# Altium project InterfaceUtil.PrjPcb
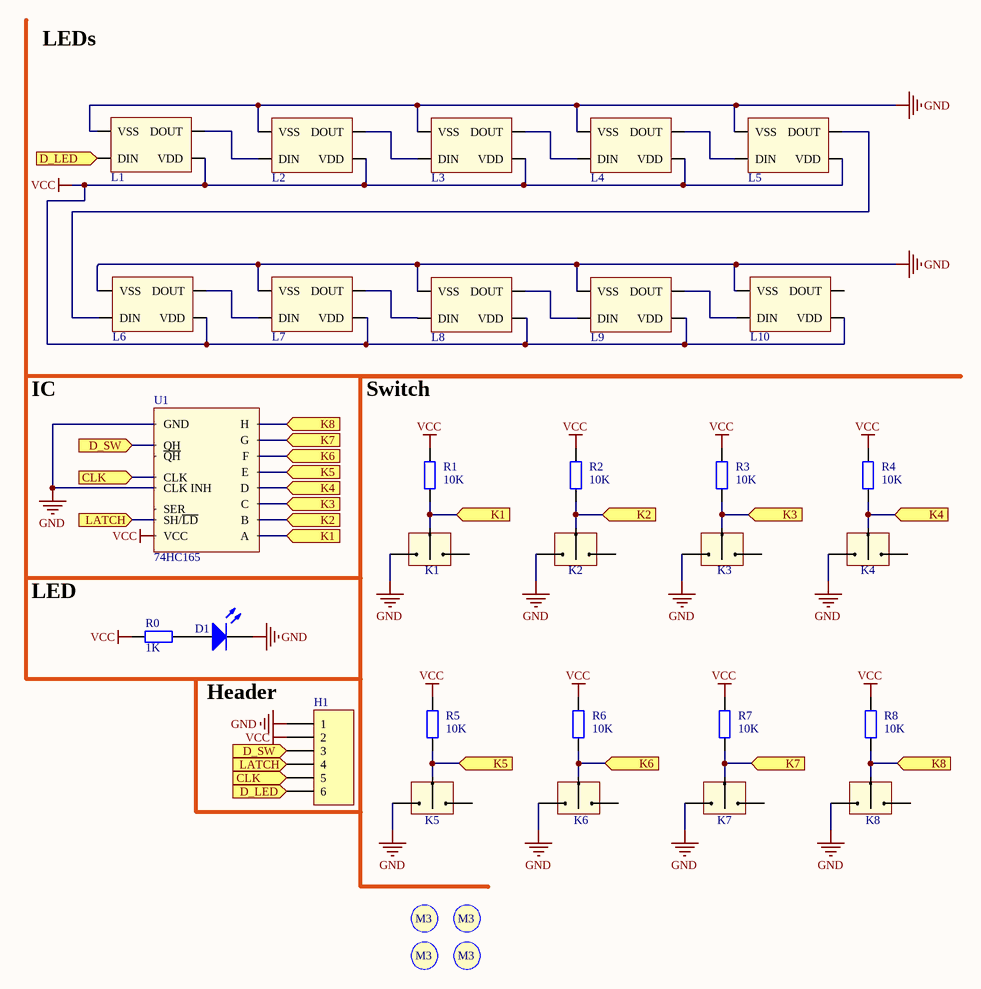
[diagram p0: InterfaceUtil.SchDoc]
1 sheet, 34 parts. Net scope: flat (ports and power ports of the same name join across sheets).
Board file: InterfaceUtil.PcbDoc

## Sheet InterfaceUtil.SchDoc
size A4

### Parts
D1  LED2  [3.2X1.6X1.1]  (value not drawn)
H1  Header 6  [MOLEX SPOX 6X1H]  (value not drawn)
K1  Switch  [SWITCH]  (value not drawn)
K2  Switch  [SWITCH]  (value not drawn)
K3  Switch  [SWITCH]  (value not drawn)
K4  Switch  [SWITCH]  (value not drawn)
K5  Switch  [SWITCH]  (value not drawn)
K6  Switch  [SWITCH]  (value not drawn)
K7  Switch  [SWITCH]  (value not drawn)
K8  Switch  [SWITCH]  (value not drawn)
L1  NeoPixel  [Neopixel]  (value not drawn)
L2  NeoPixel  [Neopixel]  (value not drawn)
L3  NeoPixel  [Neopixel]  (value not drawn)
L4  NeoPixel  [Neopixel]  (value not drawn)
L5  NeoPixel  [Neopixel]  (value not drawn)
L6  NeoPixel  [Neopixel]  (value not drawn)
L7  NeoPixel  [Neopixel]  (value not drawn)
L8  NeoPixel  [Neopixel]  (value not drawn)
L9  NeoPixel  [Neopixel]  (value not drawn)
L10  NeoPixel  [Neopixel]  (value not drawn)
R0  value 1K  [3.2X1.6X1.1]  (hidden comment: Res2)
R1  value 10K  [3.2X1.6X1.1]  (hidden comment: Res2)
R2  value 10K  [3.2X1.6X1.1]  (hidden comment: Res2)
R3  value 10K  [3.2X1.6X1.1]  (hidden comment: Res2)
R4  value 10K  [3.2X1.6X1.1]  (hidden comment: Res2)
R5  value 10K  [3.2X1.6X1.1]  (hidden comment: Res2)
R6  value 10K  [3.2X1.6X1.1]  (hidden comment: Res2)
R7  value 10K  [3.2X1.6X1.1]  (hidden comment: Res2)
R8  value 10K  [3.2X1.6X1.1]  (hidden comment: Res2)
S1  Screw M3  [Screw M3]  (value not drawn)
S2  Screw M3  [Screw M3]  (value not drawn)
S3  Screw M3  [Screw M3]  (value not drawn)
S4  Screw M3  [Screw M3]  (value not drawn)
U1  74HC165  [16 pins SOIC, TI]

### Ports
CLK, D_LED, D_SW, K1, K2, K3, K4, K5, K6, K7, K8, LATCH

### Nets
GND: D1.2(K) H1.1 K1.0(L) K2.0(L) K3.0(L) K4.0(L) K5.0(L) K6.0(L) K7.0(L) K8.0(L) L1.1(VSS) L2.1(VSS) L3.1(VSS) L4.1(VSS) L5.1(VSS) L6.1(VSS) L7.1(VSS) L8.1(VSS) L9.1(VSS) L10.1(VSS) U1.8(GND) U1.15(CLK_INH)
VCC: H1.2 L1.3(VDD) L2.3(VDD) L3.3(VDD) L4.3(VDD) L5.3(VDD) L6.3(VDD) L7.3(VDD) L8.3(VDD) L9.3(VDD) L10.3(VDD) R0.1 R1.2 R2.2 R3.2 R4.2 R5.2 R6.2 R7.2 R8.2 U1.16(VCC)
NetD1_1: D1.1(A) R0.2
NetH1_3: H1.3 U1.9(QH) ; port D_SW
NetH1_4: H1.4 U1.1(SH/~{LD}) ; port LATCH
NetH1_5: H1.5 U1.2(CLK) ; port CLK
NetH1_6: H1.6 L1.2(DIN) ; port D_LED
NetK1_1: K1.1(M) R1.1 U1.11(A) ; port K1
NetK2_1: K2.1(M) R2.1 U1.12(B) ; port K2
NetK3_1: K3.1(M) R3.1 U1.13(C) ; port K3
NetK4_1: K4.1(M) R4.1 U1.14(D) ; port K4
NetK5_1: K5.1(M) R5.1 U1.3(E) ; port K5
NetK6_1: K6.1(M) R6.1 U1.4(F) ; port K6
NetK7_1: K7.1(M) R7.1 U1.5(G) ; port K7
NetK8_1: K8.1(M) R8.1 U1.6(H) ; port K8
NetL1_4: L1.4(DOUT) L2.2(DIN)
NetL2_4: L2.4(DOUT) L3.2(DIN)
NetL3_4: L3.4(DOUT) L4.2(DIN)
NetL4_4: L4.4(DOUT) L5.2(DIN)
NetL5_4: L5.4(DOUT) L6.2(DIN)
NetL6_4: L6.4(DOUT) L7.2(DIN)
NetL7_4: L7.4(DOUT) L8.2(DIN)
NetL8_4: L8.4(DOUT) L9.2(DIN)
NetL9_4: L9.4(DOUT) L10.2(DIN)

Not connected (* = marked no-connect by the designer): K1 2(R); K2 2(R); K3 2(R); K4 2(R); K5 2(R); K6 2(R); K7 2(R); K8 2(R); L10 4(DOUT); U1 7(~{QH}) 10(SER)

### Notes on the sheet
- LEDs
- IC
- Switch
- LED
- Header
- (in symbol Screw M3) M3

### Library data of the parts
D1 = LED2: Typical RED, GREEN, YELLOW, AMBER GaAs LED; Published: 8-Jun-2000; LatestRevisionDate: 17-Jul-2002; LatestRevisionNote: Re-released for DXP Platform.; PackageVersion: Feb-2002; PackageReference: 3.2X1.6X1.1; Publisher: Altium Limited; PackageDescription: SM LED; 2 Flat Leads
H1 = Header 6: Header, 6-Pin; LatestRevisionDate: 17-Jul-2002; LatestRevisionNote: Re-released for DXP Platform.; Publisher: Altium Limited
K1-K8 = Switch: 3 pos switch, 09.03290.01
R0-R8 = Res2: Resistor; Published: 8-Jun-2000; LatestRevisionDate: 17-Jul-2002; LatestRevisionNote: Re-released for DXP Platform.; PackageReference: AXIAL-0.4; Publisher: Altium Limited; PackageDescription: Axial Device, Thru-Hole; 2 Leads; 0.4 in Pin Spacing
U1 = SN74HC165: 8 bits Shift Register